# Altium project LTEWatch.PrjPcb (part 1 of 3)
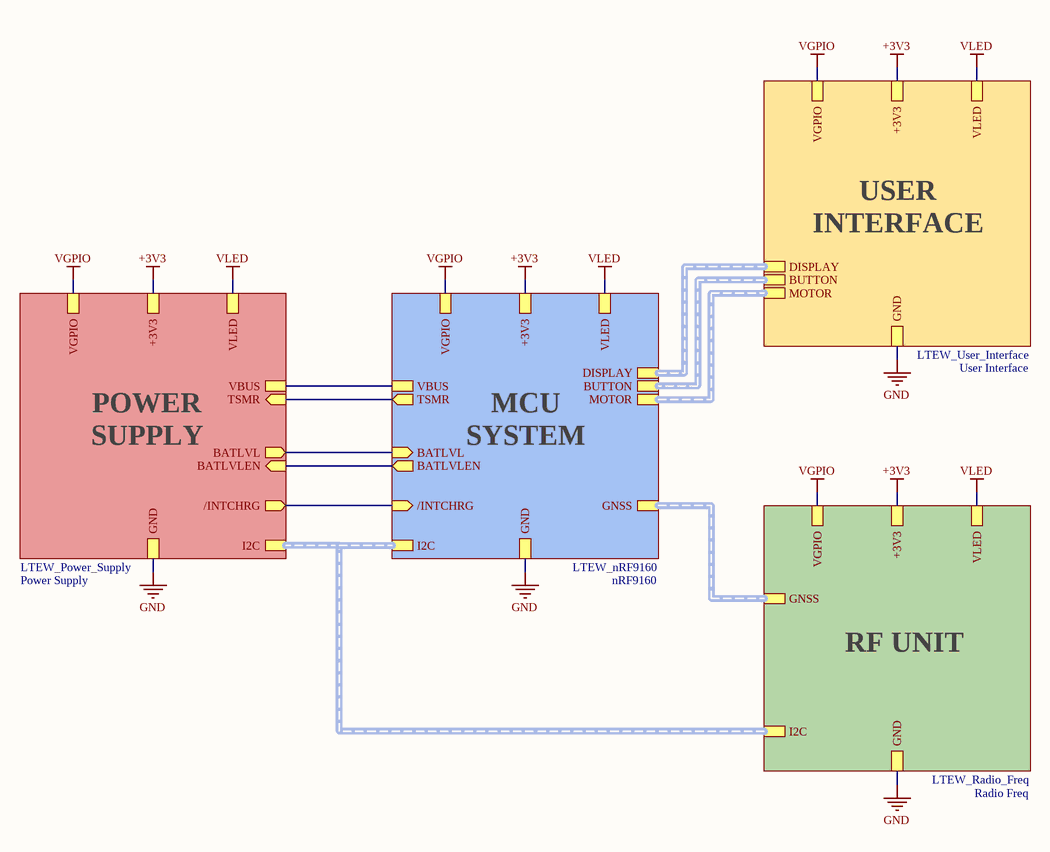
[diagram p0: LTEWatch.SchDoc]
PcbDate: 19.10.2021; PcbDesigner: Gas; PcbRevision: 1.0; SchematicDate: 19.10.2021; SchematicDesigner: Traiber T.; SchematicRevision: 1.0
6 sheets, 336 parts. Net scope: hierarchical (ports join the sheet entries above them; power ports are global).
Board file: LTEWatch.PcbDoc
Sheets:
  LTEWatch.SchDoc
    Power Supply = LTEW_Power_Supply.SchDoc
      Wireless Power Receiver = LTEW_WPC_RCVR.SchDoc
    nRF9160 = LTEW_nRF9160.SchDoc
    User Interface = LTEW_User_Interface.SchDoc
    Radio Freq = LTEW_Radio_Freq.SchDoc

## Sheet LTEWatch.SchDoc: LTEWatch
size A4; Author: Tristan Traiber; DrawnBy: Tristan Traiber; Engineer: Tristan Traiber; Organization: MSE HES-SO; Address1: HEVS; Address3: Tristan Traiber; DocumentNumber: 1; Revision: 1.0; SheetNumber: 1; SheetTotal: 6

### Sub-sheets
nRF9160 = LTEW_nRF9160: TSMR (out), BATLVL (in), +3V3, GND, BATLVLEN (out), VGPIO, /INTCHRG (in), VLED, DISPLAY (harness DISPLAY), BUTTON (harness BTN_BUS), GNSS (harness GNSS), I2C (harness I2C), VBUS, MOTOR (harness MOTOR)
Power Supply = LTEW_Power_Supply: /INTCHRG (out), +3V3, TSMR (in), GND, BATLVLEN (in), VGPIO, VLED, BATLVL (out), I2C (harness I2C), VBUS
Radio Freq = LTEW_Radio_Freq: GND, VGPIO, +3V3, VLED, GNSS (harness GNSS), I2C (harness I2C)
User Interface = LTEW_User_Interface: GND, VGPIO, +3V3, VLED, DISPLAY (harness DISPLAY), BUTTON (harness BTN_BUS), MOTOR (harness LED_BUS)

### Nets
+3V3: sheet Power Supply/+3V3, sheet nRF9160/+3V3, sheet User Interface/+3V3, sheet Radio Freq/+3V3
GND: sheet Power Supply/GND, sheet nRF9160/GND, sheet User Interface/GND, sheet Radio Freq/GND
VBUS: sheet Power Supply/VBUS, sheet nRF9160/VBUS
VGPIO: sheet Power Supply/VGPIO, sheet nRF9160/VGPIO, sheet User Interface/VGPIO, sheet Radio Freq/VGPIO
VLED: sheet Power Supply/VLED, sheet nRF9160/VLED, sheet User Interface/VLED, sheet Radio Freq/VLED
/INT: sheet Power Supply//INTCHRG, sheet nRF9160//INTCHRG
BAT_LVL: sheet Power Supply/BATLVL, sheet nRF9160/BATLVL
BAT_LVL_EN: sheet Power Supply/BATLVLEN, sheet nRF9160/BATLVLEN
BAT_TSMR: sheet Power Supply/TSMR, sheet nRF9160/TSMR

### Buses and harness runs
harness sheet nRF9160/BUTTON = sheet User Interface/BUTTON
harness sheet nRF9160/DISPLAY = sheet User Interface/DISPLAY
harness sheet nRF9160/GNSS = sheet Radio Freq/GNSS
harness sheet nRF9160/I2C = sheet Power Supply/I2C = sheet Radio Freq/I2C
harness sheet nRF9160/MOTOR = sheet User Interface/MOTOR

### Notes on the sheet
- USER INTERFACE
- POWER SUPPLY
- MCU SYSTEM
- RF UNIT
- Title
- Size:
- Date:
- A4
- Number:
- Time:
- Revision:
- Sheet
- of
- File:

## Sheet LTEW_Power_Supply.SchDoc: LTEW_Power_Supply
size A4; Author: Tristan Traiber; CompanyName: MSE HES-SO; DrawnBy: Tristan Traiber; Engineer: Tristan Traiber; Organization: MSE HES-SO; Address1: HEVS; Address3: Tristan Traiber; DocumentNumber: 3; Revision: 1.0; SheetNumber: 3; SheetTotal: 6
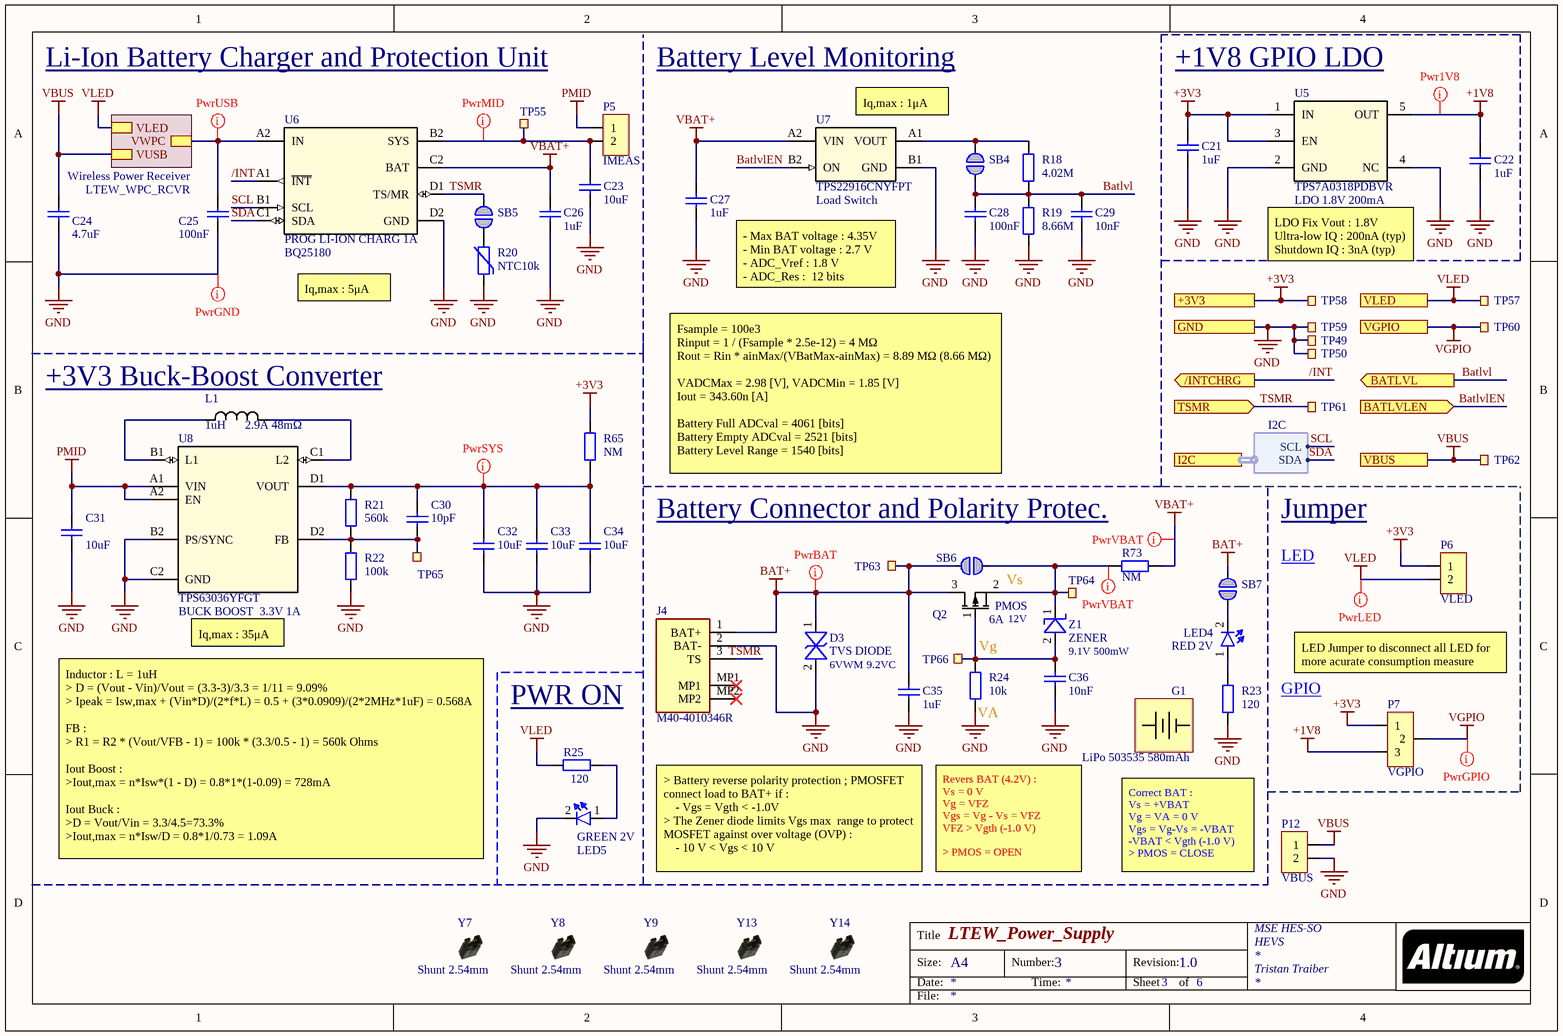
[diagram p1: LTEW_Power_Supply.SchDoc]

### Parts
C21  1uF  [C0603]
C22  1uF  [C0603]
C23  10uF  [C0603]
C24  4.7uF  [C0603]
C25  100nF  [C0603]
C26  1uF  [C0603]
C27  1uF  [C0603]
C28  100nF  [C0603]
C29  10nF  [C0603]
C30  10pF  [C0603]
C31  10uF  [C0603]
C32  10uF  [C0603]
C33  10uF  [C0603]
C34  10uF  [C0603]
C35  1uF  [C0603]
C36  10nF  [C0603]
D3  TVS DIODE  value 6VWM 9.2VC  [SP100701ETG]
G1  LiPo 503535 580mAh  [Battery_Lipo_503535]
J4  M40-4010346R  [M404010346R]
L1  2.9A 48mΩ  value 1uH  [1286ASH1R0MP2]
LED4  RED 2V  [LEDC1608X80N]
LED5  GREEN 2V  [LEDC1608X80N]
P5  IMEAS  [HDR1X2 - IMEAS]
P6  VLED  [HDR1X2 - VLED]
P7  VGPIO  [HDR1X3 - VGPIO]
P12  VBUS  [HDR1X2 - VIN]
Q2  PMOS  value 12V  Value2: 6A  [SSM3J332RLFT]
R18  4.02M  [RES0603]
R19  8.66M  [RES0603]
R20  NTC10k  [C0603]
R21  560k  [RES0603]
R22  100k  [RES0603]
R23  120  [RES0603]
R24  10k  [RES0603]
R25  120  [RES0603]
R65  NM  [RES0603]
R73  NM  [RES0603]
SB4  Solderbridge  [Solderbridge]  (value not drawn)  (no BOM)
SB5  Solderbridge  [Solderbridge]  (value not drawn)  (no BOM)
SB6  Solderbridge  [Solderbridge]  (value not drawn)  (no BOM)
SB7  Solderbridge  [Solderbridge]  (value not drawn)  (no BOM)
TP49  Ø1.0mm,SMD  [TP_SMD_Ø0.8mm]  (value not drawn)  (no BOM)
TP50  Ø1.0mm,SMD  [TP_SMD_Ø0.8mm]  (value not drawn)  (no BOM)
TP55  Ø1.0mm,SMD  [TP_SMD_Ø0.8mm]  (value not drawn)  (no BOM)
TP57  Ø1.0mm,SMD  [TP_SMD_Ø0.8mm]  (value not drawn)  (no BOM)
TP58  Ø1.0mm,SMD  [TP_SMD_Ø0.8mm]  (value not drawn)  (no BOM)
TP59  Ø1.0mm,SMD  [TP_SMD_Ø0.8mm]  (value not drawn)  (no BOM)
TP60  Ø1.0mm,SMD  [TP_SMD_Ø0.8mm]  (value not drawn)  (no BOM)
TP61  Ø1.0mm,SMD  [TP_SMD_Ø0.8mm]  (value not drawn)  (no BOM)
TP62  Ø1.0mm,SMD  [TP_SMD_Ø0.8mm]  (value not drawn)  (no BOM)
TP63  Ø1.0mm,SMD  [TP_SMD_Ø0.8mm]  (value not drawn)  (no BOM)
TP64  Ø1.0mm,SMD  [TP_SMD_Ø0.8mm]  (value not drawn)  (no BOM)
TP65  Ø1.0mm,SMD  [TP_SMD_Ø0.8mm]  (value not drawn)  (no BOM)
TP66  Ø1.0mm,SMD  [TP_SMD_Ø0.8mm]  (value not drawn)  (no BOM)
U5  TPS7A0318PDBVR  value LDO 1.8V 200mA  [SOT95P280X145-5N]
U6  BQ25180  value PROG LI-ION CHARG 1A  [BGA8C40P2X4_100X155X50]
U7  TPS22916CNYFPT  value Load Switch  [BGA4C40P2X2_78X78X50]
U8  TPS63036YFGT  value BUCK BOOST  3.3V 1A  [BGA8C40P2X4_108X181X62]
Y7  Shunt 2.54mm  [Shunt_2.54mm_Horizontal]
Y8  Shunt 2.54mm  [Shunt_2.54mm_Horizontal]
Y9  Shunt 2.54mm  [Shunt_2.54mm_Horizontal]
Y13  Shunt 2.54mm  [Shunt_2.54mm_Horizontal]
Y14  Shunt 2.54mm  [Shunt_2.54mm_Horizontal]
Z1  ZENER  value 9.1V 500mW  [SOD3716X145N]

### Sub-sheets
Wireless Power Receiver = LTEW_WPC_RCVR: VWPC, VLED, VUSB

### Ports
+3V3, /INTCHRG (out), BATLVL (out), BATLVLEN (in), GND, I2C (harness I2C), TSMR (in), VBUS, VGPIO, VLED

### Harnesses
I2C: SCL, SDA

### Nets
+1V8: C22.2 P7.3 U5.5(OUT)
+3V3: C21.2 P6.1 P7.1 R65.2 TP58.1 U5.1(IN) U5.3(EN) ; port +3V3
BAT+: C35.2 D3.1 J4.1(BAT+) Q2.3(D) SB6.1 SB7.1 TP63.1
GND: C21.1 C22.1 C23.1 C24.2 C25.1 C26.1 C27.1 C28.1 C29.1 C31.1 C32.1 C33.1 C34.1 C35.1 C36.1 D3.2 J4.2(BAT-) LED5.2(K) P12.2 R19.1 R20.1 R22.1 R23.1 R24.1 TP49.1 TP50.1 TP59.1 U5.2(GND) U5.4(NC) U6.D2(GND) U7.B1(GND) U8.B2(PS/SYNC) U8.C2(GND) ; port GND
PMID: C31.2 P5.1 U8.A1(VIN) U8.A2(EN)
VBAT+: C26.2 C27.2 R73.1 U6.C2(BAT) U7.A2(VIN)
VBUS: C24.1 P12.1 TP62.1 ; port VBUS, sheet Wireless Power Receiver/VUSB
VGPIO: P7.2 TP60.1 ; port VGPIO
VLED: P6.2 R25.1 TP57.1 ; port VLED, sheet Wireless Power Receiver/VLED
/INT: U6.A1(~{INT}) ; port /INTCHRG
Batlvl: C28.2 C29.2 R18.1 R19.2 SB4.2 ; port BATLVL  [project net BAT_LVL]
BatlvlEN: U7.B2(ON) ; port BATLVLEN  [project net BAT_LVL_EN]
SCL: U6.B1(SCL) ; port I2C.SCL  [project net P0.09/SCL]
SDA: U6.C1(SDA) ; port I2C.SDA  [project net P0.08/SDA]
TSMR: J4.3(TS) SB5.1 TP61.1 U6.D1(TS/MR) ; port TSMR  [project net BAT_TSMR]
VWPC: C25.2 U6.A2(IN) ; sheet Wireless Power Receiver/VWPC
NetC23_2: C23.2 P5.2 TP55.1 U6.B2(SYS)
NetC30_1: C30.1 R21.1 R22.2 TP65.1 U8.D2(FB)
NetC30_2: C30.2 C32.2 C33.2 C34.2 R21.2 R65.1 U8.D1(VOUT)
NetC36_2: C36.2 Q2.1(G) R24.2 TP66.1 Z1.2(A)
NetL1_1: L1.1 U8.C1(L2)
NetL1_2: L1.2 U8.B1(L1)
NetLED4_1: LED4.1(A) R23.2
NetLED4_2: LED4.2(K) SB7.2
NetLED5_1: LED5.1(A) R25.2
NetQ2_2: Q2.2(S) R73.2 SB6.2 TP64.1 Z1.1(K)
NetR18_2: R18.2 SB4.1 U7.A1(VOUT)
NetR20_2: R20.2 SB5.2

Not connected (* = marked no-connect by the designer): J4 MP1* MP2*

### Layout directives
mark named PwrUSB: VWPC
mark named PwrMID: NetC23_2
mark named PwrSYS: NetC30_2
mark named PwrGND: GND
mark named PwrVBAT: NetQ2_2, VBAT+
mark named PwrBAT: BAT+
mark named PwrGPIO: VGPIO
mark named Pwr1V8: +1V8
mark named PwrLED: VLED

### Notes on the sheet
- Li-Ion Battery Charger and Protection Unit
- Battery Level Monitoring
- (near U7) Iq,max : 1μA
- (near U5) +1V8 GPIO LDO
- (near U6) Iq,max : 5μA
- - Max BAT voltage : 4.35V
  - Min BAT voltage : 2.7 V
  - ADC_Vref : 1.8 V
  - ADC_Res :  12 bits
- LDO Fix Vout : 1.8V
  Ultra-low IQ : 200nA (typ)
  Shutdown IQ : 3nA (typ)
- (near L1) +3V3 Buck-Boost Converter
- Fsample = 100e3
  Rinput = 1 / (Fsample * 2.5e-12) = 4 MΩ
  Rout = Rin * ainMax/(VBatMax-ainMax) = 8.89 MΩ (8.66 MΩ)
  VADCMax = 2.98 [V], VADCMin = 1.85 [V]
  Iout = 343.60n [A]
  Battery Full ADCval = 4061 [bits]
  Battery Empty ADCval = 2521 [bits]
  Battery Level Range = 1540 [bits]
- Battery Connector and Polarity Protec.
- Vs
- LED
- Jumper
- (near U8) Iq,max : 35μA
- Vg
- (near R25) PWR ON
- (near R24) VA
- GPIO
- LED Jumper to disconnect all LED for more acurate consumption measure
- Inductor : L = 1uH
  > D = (Vout - Vin)/Vout = (3.3-3)/3.3 = 1/11 = 9.09%
  > Ipeak = Isw,max + (Vin*D)/(2*f*L) = 0.5 + (3*0.0909)/(2*2MHz*1uF) = 0.568A
  FB :
  > R1 = R2 * (Vout/VFB - 1) = 100k * (3.3/0.5 - 1) = 560k Ohms
  Iout Boost :
  >Iout,max = n*Isw*(1 - D) = 0.8*1*(1-0.09) = 728mA
  Iout Buck :
  >D = Vout/Vin = 3.3/4.5=73.3%
  >Iout,max = n*Isw/D = 0.8*1/0.73 = 1.09A
- > Battery reverse polarity protection ; PMOSFET connect load to BAT+ if :
  - Vgs = Vgth < -1.0V
  > The Zener diode limits Vgs max  range to protect MOSFET against over voltage (OVP) :
  - 10 V < Vgs < 10 V
- Revers BAT (4.2V) :
  Vs = 0 V
  Vg = VFZ
  Vgs = Vg - Vs = VFZ
  VFZ > Vgth (-1.0 V)
  > PMOS = OPEN
- Correct BAT :
  Vs = +VBAT
  Vg = VA = 0 V
  Vgs = Vg-Vs = -VBAT
  -VBAT < Vgth (-1.0 V)
  > PMOS = CLOSE
- Title
- Size:
- Date:
- A4
- Number:
- Time:
- Revision:
- Sheet
- of
- File:

### Library data of the parts
C21 C22 C26 C27 C35 = C_1u: 1 µF ±10% 25V Ceramic Capacitor X7R 0603 (1608 Metric); Manufacturer_Part_Number: CL10B105KA8NNNC; Manufacturer_Name: Samsung Electro-Mechanics; Supplier 1: Mouser; Supplier Part Number 1: 187-CL10B105KA8NNNC; Value: 1uF; Price Unit: 0.10
C23 C31-C34 = C_10u: 10 µF ±10% 25V Ceramic Capacitor X5R 0805 (2012 Metric); Manufacturer_Part_Number: GRM188R61E106KA73J; Manufacturer_Name: Murata Electronics; Supplier 1: Mouser; Value: 10uF; Supplier Part Number 1: 81-GRM188R61E106KA3J; Unit Price: 0.280
C24 = C_4.7u: 4.7 µF ±10% 25V Condensateurs céramique X6S 0603 (1608 métrique); Manufacturer_Part_Number: GRM188C81E475KE11D; Manufacturer_Name: Murata Electronics; Supplier 1: Digi-Key; Value: 4.7uF; Supplier Part Number 1: 490-7199-1-ND; Unit Price: 0.24
C25 C28 = C_100n: 0.1 µF ±10% 25V Condensateurs céramique X7R 0603 (1608 métrique); Manufacturer_Part_Number: CL10B104KA8NNNC; Manufacturer_Name: Samsung Electro-Mechanics; Supplier 1: Digi-Key; Value: 100nF; Supplier Part Number 1: 1276-1006-1-ND; Unit Price: 0.10
C29 C36 = C_10n: 10000 pF ±5% 25V Condensateurs céramique C0G, NP0 0603 (1608 métrique); Manufacturer_Part_Number: C1608C0G1E103J080AA; Manufacturer_Name: TDK Corporation; Value: 10nF; Supplier 1: Digi-Key; Supplier Part Number 1: 445-2664-1-ND; Unit Price: 0.270
C30 = C_10p: 10 pF ±5% 50V Ceramic Capacitor C0G, NP0 0603 (1608 Metric); Manufacturer_Part_Number: 06035A100JAT2A; Manufacturer_Name: KYOCERA AVX; Supplier 1: Digi-Key; Value: 10pF; Supplier Part Number 1: 478-1163-1-ND; Unit Price: 0.10
D3 = D_TVS: 9.2V Clamp 5A (8/20µs) Ipp Tvs Diode Surface Mount SOD-882; Manufacturer_Name: LITTELFUSE; Manufacturer_Part_Number: SP1007-01ETG; Datasheet Link: https://www.littelfuse.com/~/media/electronics/datasheets/tvs_diode_arrays/littelfuse_tvs_diode_array_sp1007_datasheet.pdf.pdf; Height: 0.6mm; Supplier 1: Digi-Key; Supplier Part Number 1: F6187CT-ND; Unit Price: 0.40
G1 = Battery: 503535 3.8v 580mAh round lipo battery cells / (Order : shorturl.at/tEFMZ); ComponentLink1Description: Order; ComponentLink1URL: https://batteryzone.de/products/503535-580mah-hochspannung-3-8v-runde-polymer-smart-watch-moxibustion-instrument-auto-smart-box-batterie?_pos=1&_sid=59cfd2d74&_ss=r; Value: LiPo 503535 580mAh; Manufacturer_Name: -; Manufacturer_Part_Number: https://batteryzone.de/products/503535-580mah-hochspannung-3-8v-runde-polymer-smart-watch-moxibustion-instrument-auto-smart-box-batterie?_pos=1&_sid=59cfd2d74&_ss=r; Supplier Part Number 1: https://batteryzone.de/products/503535-580mah-hochspannung-3-8v-runde-polymer-smart-watch-moxibustion-instrument-auto-smart-box-batterie?_pos=1&_sid=59cfd2d74&_ss=r; Unit Price: 12.50
J4 = CON_BAT_3POS: Connector Header Surface Mount, Right Angle 3 position 0.039" (1.00mm); Manufacturer_Name: Harwin; Datasheet Link: https://cdn.harwin.com/pdfs/M40-401.pdf; Height: 3.25mm; Manufacturer_Part_Number: M40-4010346R; Mouser Part Number: 855-M40-4010346R; Mouser Price/Stock: https://www.mouser.co.uk/ProductDetail/Harwin/M40-4010346R?qs=ulE8k0yEMYbY8tNiZulTaA%3D%3D; Supplier 1: Digi-Key; Supplier Part Number 1: M40-4010346R-ND
L1 = L_1u: 1 µH Shielded Drum Core, Wirewound Inductor 2.9 A 48mOhm Max 0806 (2016 Metric); Manufacturer_Part_Number: DFE201612E-1R0M=P2; Manufacturer_Name: Murata Electronics; Copyright: Copyright (C) 2022 Ultra Librarian. All rights reserved.; Supplier 1: Digi-Key; Supplier Part Number 1: 490-16593-1-ND; Unit Price: 0.35
LED4 = LED_R: Red 625nm LED Indication - Discrete 2V 0603 (1608 Metric); Manufacturer_Name: QT Brightek (QTB); Manufacturer_Part_Number: 150060RS75000; Datasheet Link: http://www.qt-brightek.com/datasheet/QBLP617_series.pdf; Height: 1.3mm; Supplier 1: Digi-Key; Supplier Part Number 1: 732-4978-1-ND; Unit Price: 0.15
LED5 = LED_G: Green 570nm LED Indication - Discrete 2V 0603 (1608 Metric); Manufacturer_Name: QT Brightek (QTB); Manufacturer_Part_Number: 150060VS75000; Datasheet Link: http://www.qt-brightek.com/datasheet/QBLP617_series.pdf; Height: 1.3mm; Supplier 1: Digi-Key; Supplier Part Number 1: 732-4980-1-ND; Unit Price: 0.15
P5 P6 P12 = H_2POS: Header, 2-Pin; Manufacturer_Part_Number: 10129378-902001BLF; Manufacturer_Name: Amphenol ICC (FCI); Supplier 1: Mouser; Supplier Part Number 1: 649-1012937890201BLF; Unit Price: 0.10
P7 = H_3POS: Header, 3-Pin; Manufacturer_Name: Harwin Inc.; Manufacturer_Part_Number: M20-9990345; Supplier 1: Digi-key; Supplier Part Number 1: 952-2263-ND; Unit Price: 0.17
Q2 = MOS-P: P-Channel 12 V 6A (Ta) 1W (Ta) Surface Mount SOT-23F; Manufacturer_Name: Toshiba; Manufacturer_Part_Number: SSM3J338R; Datasheet Link: http://toshiba.semicon-storage.com/info/docget.jsp?did=30384&prodName=SSM3J338R; Supplier 1: Digi-Key; Supplier Part Number 1: SSM3J338RLFCT-ND; Unit Price: 0.38
R18 = R_4M: 4.02 MOhms ±1% 0,1W, 1/10W Pavé résistif 0603 (1608 métrique) Résistant à l’humidité Couche épaisse; Manufacturer_Part_Number: RC0603FR-074M02L; Manufacturer_Name: YAGEO; Value: 4.02M; Supplier 1: Digi-Key; Supplier Part Number 1: YAG5698CT-ND; Unit Price: 0.10
R19 R65 R73 = R_8.66M: 8.66 MOhms ±1% 0,1W, 1/10W Pavé résistif 0603 (1608 métrique) AutomobileAEC-Q200 Couche épaisse; Manufacturer_Part_Number: CRCW06038M66FKEA; Manufacturer_Name: YAGEO; Supplier 1: Digi-Key; Supplier Part Number 1: 541-8.66MHCT-ND; Unit Price: 0.10
  R19: Value: 8.66M
  R65 R73: Value: NM
R20 = R_NTC_10k: NTC Thermistor 10k 0603 (1608 Metric); Manufacturer_Part_Number: ERT-J1VR103J; Manufacturer_Name: Panasonic; Value: NTC10k; Supplier 1: Digi-Key; Supplier Part Number 1: P10547CT-ND; Unit Price: 0.18
R21 = R_560k: 560 kOhms ±1% 0.1W, 1/10W Chip Resistor 0603 (1608 Metric) Automotive AEC-Q200, Moisture Resistant Thick Film; Manufacturer_Part_Number: AC0603FR-07560KL; Manufacturer_Name: YAGEO; Value: 560k; Supplier 1: Digi-Key; Supplier Part Number 1: 311-560KLDCT-ND; Unit Price: 0.10
R22 = R_100k: RES SMD 100K OHM 1% 1/8W 0603; Manufacturer_Part_Number: RC0805FR-07100KL; Manufacturer_Name: YAGEO; Supplier 1: Digi-Key; Supplier Part Number 1: 311-100KCRCT-ND; Value: 100k; Unit Price: 0.10
R23 R25 = R_120: 1 MOhms ±1% 0.1W, 1/10W Chip Resistor 0603 (1608 Metric) Automotive AEC-Q200 Thick Film; Manufacturer_Part_Number: CRGCQ0603F120R; Manufacturer_Name: YAGEO; Value: 120; Supplier 1: Digi-Key; Supplier Part Number 1: A129677CT-ND; Unit Price: 0.10
R24 = R_10k: 10 kOhms ±1% 0.1W, 1/10W Chip Resistor 0603 (1608 Metric) Moisture Resistant Thick Film; Manufacturer_Part_Number: RC0805FR-0710KL; Manufacturer_Name: YAGEO; Value: 10k; Supplier 1: Digi-Key; Supplier Part Number 1: 311-10.0KHRCT-ND; Unit Price: 0..10
SB4-SB7 = Solderbridge: Manufacturer: N.A.; Pad Count: 2; Part Number: Solderbridge; Manufacturer Part Number: N.A.; LatestRevisionDate: 2009-12-14; Published: 2009-12-14; Value: Solderbridge; Note: N.A.; Artikkelnr Noca: N.A.; Footprint Doc: Solderbridge; Part number IPS: N.A.; ComponentLink1URL: N.A.; ComponentLink1Description: Datasheet; ComponentLink2URL: N.A.; ComponentLink2Description: Supplier link; HelpURL: N.A.; Supplier 1: N.A.; Supplier Part Number 1: N.A.; Supplier 2: N.A.; Supplier Part Number 2: N.A.; PartId: 100500458; Component Class: Connectors
TP49 TP50 TP55 TP57-TP66 = TP_SMD: 0.8 mm circular SMD testpad; Part Number: TP_SMD_Ø1.0MM; Manufacturer: Nordic Semiconductor; Manufacturer Part Number: N.A.; Pad Count: 1; ComponentLink1URL: N.A.; ComponentLink1Description: Datasheet; ComponentLink2URL: N.A.; ComponentLink2Description: Supplier link; HelpURL: N.A.; Footprint Doc: TP_SMD_Ø1.0mm; LatestRevisionDate: 2013-06-11; Published: 2013-06-11; Value: Ø1.0mm,SMD; Note: N.A.; Supplier 1: N.A.; Supplier Part Number 1: N.A.; Supplier 2: N.A.; Supplier Part Number 2: N.A.; Artikkelnr Noca: N.A.; Part number IPS: N.A.; PartId: 100500475; Component Class: Connectors
U5 = IC_TPS7A0318PDBVR: Linear Voltage Regulator IC Positive Fixed 1 Output 200mA SOT-23-5; Manufacturer_Part_Number: TPS7A0312PDBVR; Manufacturer_Name: Texas Instruments; Type: DEV; Supplier 1: Digi-Key; Copyright: Copyright (C) 2022 Ultra Librarian. All rights reserved.; Supplier Part Number 1: 296-TPS7A0318PDBVRCT-ND; Unit Price: 0.93
U6 = IC_BQ25180YBGT: Charger IC Lithium Ion/Polymer, Lithium Iron Phosphate 8-DSBGA; Manufacturer_Part_Number: BQ25180YBGR; Manufacturer_Name: Texas Instruments; Type: DEV; Copyright: Copyright (C) 2022 Ultra Librarian. All rights reserved.; Supplier 1: Mouser; Supplier Part Number 1: 595-BQ25180YBGR; Unit Price: 2.75
U7 = SW_LOAD_SW: Power Switch/Driver 1:1 P-Channel 2A 4-DSBGA; Manufacturer_Name: Texas Instruments; Type: DEV; RefDes: RefDes; Copyright: Copyright (C) 2022 Ultra Librarian. All rights reserved.; Manufacturer_Part_Number: TPS22916CNYFPT; Supplier 1: Mouser; Supplier Part Number 1: 595-TPS22916CNYFPT; Unit Price: 1.22
U8 = IC_TPS63036YFGT: Buck-Boost Switching Regulator IC Positive Adjustable 1.2V 1 Output 1A (Switch) 8-UFBGA, DSBGA; Mfr_Name: Texas Instruments; Copyright: Copyright (C) 2022 Ultra Librarian. All rights reserved.; Supplier 1: Mouser; Supplier Part Number 1: 595-TPS63036YFGT; Manufacturer_Part_Number: TPS63036YFGT; Unit Price: 2.69
Y7-Y9 Y13 Y14 = SHUNT JUMPER 2.54mm BLACK GOLD Horizontal: Shunt Jumper 2.54mm Black; Manufacturer Part Number: SPC02SYAN; Manufacturer_Name: Sullins Connector Solutions; ComponentLink1URL: N.A.; ComponentLink1Description: Datasheet; ComponentLink2URL: N.A.; ComponentLink2Description: Supplier link; Footprint Doc: SHUNT JUMPER 2.54mm; Value: Shunt 2.54mm; Component Class: Connectors; Supplier 1: Digi-Key; Supplier Part Number 1: S9001-ND; Unit Price: 0.10
Z1 = D_ZENER_9V1: Zener Diode 9.1 V 500 mW ±6% Surface Mount SOD-123; Manufacturer_Name: Diodes Inc.; Manufacturer_Part_Number: BZT52C9V1S-7-F; Datasheet Link: https://www.diodes.com/assets/Datasheets/ds18004.pdf; Height: 1.45mm; Supplier 1: Digi-Key; Supplier Part Number 1: BZT52C9V1-FDICT-ND; Unit Price: 0.30

## Sheet LTEW_WPC_RCVR.SchDoc: LTEW_WPC_RCVR
size A4; DrawnBy: Tristan Traiber; Engineer: Tristan Traiber; Organization: MSE HES-SO; Address1: HEVS; Address3: Tristan Traiber; DocumentNumber: 4; Revision: 1.0; SheetNumber: 4; SheetTotal: 6
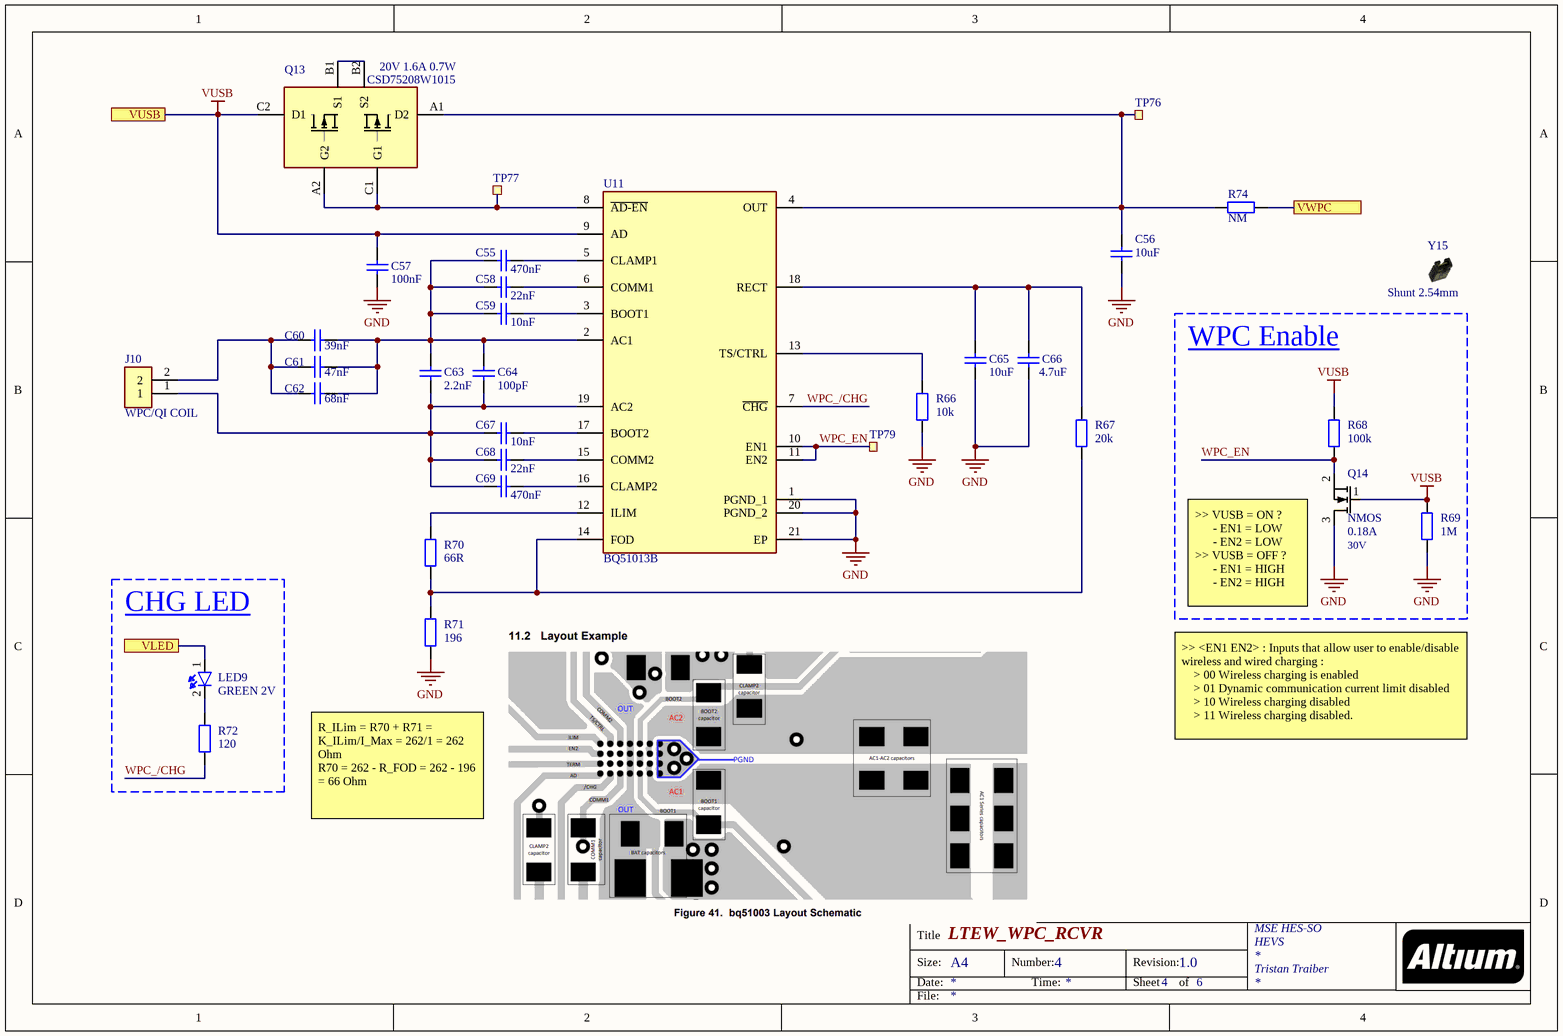
[diagram p2: LTEW_WPC_RCVR.SchDoc]

### Parts
C55  470nF  [C0603]
C56  10uF  [C0603]
C57  100nF  [C0603]
C58  22nF  [C0603]
C59  10nF  [C0603]
C60  39nF  [C0603]
C61  47nF  [C0603]
C62  68nF  [C0603]
C63  2.2nF  [C0603]
C64  100pF  [C0603]
C65  10uF  [C0603]
C66  4.7uF  [C0603]
C67  10nF  [C0603]
C68  22nF  [C0603]
C69  470nF  [C0603]
J10  WPC/QI COIL  [23839422]
LED9  GREEN 2V  [LEDC1608X80N]
Q13  20V 1.6A 0.7W  Manufacturer_Part_Number: CSD75208W1015  [BGA6C50P2X3_95X145X62]
Q14  NMOS  value 30V  Value2: 0.18A  [SOT65P210X110-3N]
R66  10k  [RES0603]
R67  20k  [RES0603]
R68  100k  [RES0603]
R69  1M  [RES0603]
R70  66R  [RES0603]
R71  196  [RES0603]
R72  120  [RES0603]
R74  NM  [RES0603]
TP76  Ø1.0mm,SMD  [TP_SMD_Ø0.8mm]  (value not drawn)  (no BOM)
TP77  Ø1.0mm,SMD  [TP_SMD_Ø0.8mm]  (value not drawn)  (no BOM)
TP79  Ø1.0mm,SMD  [TP_SMD_Ø0.8mm]  (value not drawn)  (no BOM)
U11  BQ51013B  [BQ51050BRHLR]
Y15  Shunt 2.54mm  [Shunt_2.54mm_Horizontal]

### Blocks framed on the sheet
WPC Enable: Q14 R68 R69
CHG LED: LED9 R72

### Ports
VLED, VUSB, VWPC

### Nets
GND: C56.1 C57.1 C65.1 C66.1 Q14.3(D) R66.1 R69.1 R71.1 U11.1(PGND_1) U11.20(PGND_2) U11.21(EP)
VLED: LED9.1(A) ; port VLED
VUSB: C57.2 Q13.C2(D1) Q14.1(G) R68.2 R69.2 U11.9(AD) ; port VUSB  [project net VBUS]
VWPC: R74.1 ; port VWPC
WPC_/CHG: R72.1 U11.7(~{CHG})
WPC_EN: Q14.2(S) R68.1 TP79.1 U11.10(EN1) U11.11(EN2)
NetC55_1: C55.1 C58.1 C59.1 C60.2 C61.2 C62.2 C63.2 C64.2 U11.2(AC1)
NetC55_2: C55.2 U11.5(CLAMP1)
NetC56_2: C56.2 Q13.A1(D2) R74.2 TP76.1 U11.4(OUT)
NetC58_2: C58.2 U11.6(COMM1)
NetC59_2: C59.2 U11.3(BOOT1)
NetC60_1: C60.1 C61.1 C62.1 J10.2
NetC63_1: C63.1 C64.1 C67.1 C68.1 C69.1 J10.1 U11.19(AC2)
NetC65_2: C65.2 C66.2 R67.2 U11.18(RECT)
NetC67_2: C67.2 U11.17(BOOT2)
NetC68_2: C68.2 U11.15(COMM2)
NetC69_2: C69.2 U11.16(CLAMP2)
NetLED9_2: LED9.2(K) R72.2
NetQ13_A2: Q13.A2(G2) Q13.C1(G1) TP77.1 U11.8(~{AD-EN})
NetQ13_B1: Q13.B1(S1) Q13.B2(S2)
NetR66_2: R66.2 U11.13(TS/CTRL)
NetR67_1: R67.1 R70.1 R71.2 U11.14(FOD)
NetR70_2: R70.2 U11.12(ILIM)

### Notes on the sheet
- (near Q14) >> VUSB = ON ?
  - EN1 = LOW
  - EN2 = LOW
  >> VUSB = OFF ?
  - EN1 = HIGH
  - EN2 = HIGH
- >> <EN1 EN2> : Inputs that allow user to enable/disable wireless and wired charging :
  > 00 Wireless charging is enabled
  > 01 Dynamic communication current limit disabled
  > 10 Wireless charging disabled
  > 11 Wireless charging disabled.
- R_ILim = R70 + R71 = K_ILim/I_Max = 262/1 = 262 Ohm
  R70 = 262 - R_FOD = 262 - 196 = 66 Ohm
- Title
- Size:
- Date:
- A4
- Number:
- Time:
- Revision:
- Sheet
- of
- File:

### Library data of the parts
C55 C69 = C_470n: 0.47 µF ±10% 25V Ceramic Capacitor X7R 0603 (1608 Metric); Manufacturer_Part_Number: GRM188R71E474KA12D; Manufacturer_Name: Murata Electronics; Value: 470nF; Supplier 1: Digi-Key; Supplier Part Number 1: 490-3291-1-ND; Unit Price: 0.17
C56 C65 = C_10u: as C23 on sheet LTEW_Power_Supply; Supplier 1: Mouser; Value: 10uF; Supplier Part Number 1: 81-GRM188R61E106KA3J; Unit Price: 0.280
C57 = C_100n: as C25 on sheet LTEW_Power_Supply; Supplier 1: Digi-Key; Value: 100nF; Supplier Part Number 1: 1276-1006-1-ND; Unit Price: 0.10
C58 C68 = C_22n: 0.022 µF ±10% 25V Ceramic Capacitor X7R 0603 (1608 Metric); Manufacturer_Part_Number: C0603C223K3RAC7867; Manufacturer_Name: KEMET; Value: 22nF; Supplier 1: Digi-Key; Supplier Part Number 1: 399-C0603C223K3RAC7867CT-ND; Unit Price: 0.100
C59 C67 = C_10n: as C29 on sheet LTEW_Power_Supply; Value: 10nF; Supplier 1: Digi-Key; Supplier Part Number 1: 445-2664-1-ND; Unit Price: 0.270
C60 = C_39n: 0.039 µF ±10% 50V Ceramic Capacitor X7R 0603 (1608 Metric); Manufacturer_Part_Number: 0603B393K500CT; Manufacturer_Name: Walsin Technology Corporation; Value: 39nF; Unit Price: 0.10; Supplier 1: Digi-Key; Supplier Part Number 1: 1292-1436-1-ND
C61 = C_47n: 0.047 µF ±10% 25V Ceramic Capacitor X7R 0603 (1608 Metric); Manufacturer_Part_Number: 06033C473KAT2A; Manufacturer_Name: KYOCERA AVX; Value: 47nF; Unit Price: 0.10; Supplier 1: Digi-Key; Supplier Part Number 1: 478-1235-6-ND
C62 = C_68n: 0.068 µF ±10% 25V Ceramic Capacitor X7R 0603 (1608 Metric); Manufacturer_Part_Number: 0603B683K250CT; Manufacturer_Name: Walsin Technology Corporation; Value: 68nF; Unit Price: 0.10; Supplier 1: Digi-Key; Supplier Part Number 1: 1292-1462-1-ND
C63 = C_2.2n: 2200 pF ±5% 25V Ceramic Capacitor X7R 0603 (1608 Metric); Manufacturer_Part_Number: 06033C222JAT2A; Manufacturer_Name: KYOCERA AVX; Value: 2.2nF; Unit Price: 0.10; Supplier 1: Digi-Key; Supplier Part Number 1: 478-12683-1-ND
C64 = C_100p: 100 pF ±5% 25V Ceramic Capacitor C0G, NP0 0603 (1608 Metric); Manufacturer_Part_Number: 06033A101JAT2A; Manufacturer_Name: KYOCERA AVX; Value: 100pF; Unit Price: 0.10; Supplier 1: Digi-Key; Supplier Part Number 1: 478-06033A101JAT2ACT-ND
C66 = C_4.7u: as C24 on sheet LTEW_Power_Supply; Supplier 1: Digi-Key; Value: 4.7uF; Supplier Part Number 1: 490-7199-1-ND; Unit Price: 0.24
J10 = CONN_WPC_IND: 2 Position Wire to Board Terminal Block Horizontal with Board 0.138" (3.50mm) Surface Mount; Manufacturer_Name: TE Connectivity; Manufacturer_Part_Number: 2383942-2; Datasheet Link: https://www.te.com/commerce/DocumentDelivery/DDEController?Action=showdoc&DocId=Customer+Drawing%7F2383942%7FA1%7Fpdf%7FEnglish%7FENG_CD_2383942_A1.pdf%7F2383942-2; Height: 8.65mm; Supplier 1: Digi-Key; Supplier Part Number 1: 17-2383942-2CT-ND; Unit Price: 2.77
LED9 = LED_G: as LED5 on sheet LTEW_Power_Supply; Datasheet Link: http://www.qt-brightek.com/datasheet/QBLP617_series.pdf; Height: 1.3mm; Supplier 1: Digi-Key; Supplier Part Number 1: 732-4980-1-ND; Unit Price: 0.15
Q13 = MOS_2PCH: Mosfet Array 2 P-Channel (Dual) Common Source 20V 1.6A 750mW Surface Mount 6-DSBGA (1x1.5); Manufacturer_Name: Texas Instruments; Datasheet Link: http://www.ti.com/lit/ds/symlink/csd75208w1015.pdf; Height: 0.625mm; Value: 20V 1.6A 0.7W; Supplier 1: Digi-Key; Supplier Part Number 1: 296-38339-1-ND; Unit Price: 0.60
Q14 = MOS-N: N-Channel 30 V 180mA (Ta) 260mW (Ta), 1.1W (Tc) Surface Mount SOT-323; Manufacturer_Name: NXP; Manufacturer_Part_Number: NX3020NAKW; Datasheet Link: https://datasheetspdf.com/pdf-file/1379402/nexperia/NX3020NAKW/1; Height: 1.1mm; Supplier 1: Digi-Key; Supplier Part Number 1: 1727-1288-1-ND; Unit Price: 0.30
R66 = R_10k: as R24 on sheet LTEW_Power_Supply; Value: 10k; Supplier 1: Digi-Key; Supplier Part Number 1: 311-10.0KHRCT-ND; Unit Price: 0..10
R67 = R_20k: 20 kOhms ±1% 0.1W, 1/10W Chip Resistor 0603 (1608 Metric) Moisture Resistant Thick Film; Manufacturer_Part_Number: RC0805FR-0710KL; Manufacturer_Name: YAGEO; Value: 20k; Supplier 1: Digi-Key; Supplier Part Number 1: 311-20.0KHRCT-ND; Unit Price: 0.10
R68 = R_100k: as R22 on sheet LTEW_Power_Supply; Supplier 1: Digi-Key; Supplier Part Number 1: 311-100KCRCT-ND; Value: 100k; Unit Price: 0.10
R69 = R_1M: 1 MOhms ±1% 0.1W, 1/10W Chip Resistor 0603 (1608 Metric) Automotive AEC-Q200 Thick Film; Manufacturer_Part_Number: ERJ-3EKF1004V; Manufacturer_Name: YAGEO; Value: 1M; Supplier 1: Digi-Key; Supplier Part Number 1: P1.00MHCT-ND; Unit Price: 0.10
R70 = R_66: 66.5 Ohms ±1% 0.1W, 1/10W Chip Resistor 0603 (1608 Metric) Moisture Resistant Thick Film; Manufacturer_Part_Number: RC0603FR-0766R5L; Manufacturer_Name: YAGEO; Value: 66R; Unit Price: 0.10; Supplier 1: Digi-Key; Supplier Part Number 1: 311-66.5HRCT-ND
R71 = R_196: 196 Ohms ±1% 0.1W, 1/10W Chip Resistor 0603 (1608 Metric) Moisture Resistant Thick Film; Manufacturer_Part_Number: RC0603FR-07196RL; Manufacturer_Name: YAGEO; Value: 196; Supplier 1: Digi-Key; Supplier Part Number 1: 311-196HRDKR-ND; Unit Price: 0.10
R72 = R_120: as R23 on sheet LTEW_Power_Supply; Value: 120; Supplier 1: Digi-Key; Supplier Part Number 1: A129677CT-ND; Unit Price: 0.10
R74 = R_8.66M: as R19 on sheet LTEW_Power_Supply; Value: NM; Supplier 1: Digi-Key; Supplier Part Number 1: 541-8.66MHCT-ND; Unit Price: 0.10
TP76 TP77 TP79 = TP_SMD: as TP49 on sheet LTEW_Power_Supply; ComponentLink1URL: N.A.; ComponentLink1Description: Datasheet; ComponentLink2URL: N.A.; ComponentLink2Description: Supplier link; HelpURL: N.A.; Footprint Doc: TP_SMD_Ø1.0mm; LatestRevisionDate: 2013-06-11; Published: 2013-06-11; Value: Ø1.0mm,SMD; Note: N.A.; Artikkelnr Noca: N.A.; Part number IPS: N.A.; Supplier 1: N.A.; Supplier Part Number 1: N.A.; Supplier 2: N.A.; Supplier Part Number 2: N.A.; PartId: 100500475; Component Class: Connectors
U11 = IC_WPC_VQFN: Wireless Power Receiver PMIC 20-VQFN (3.5x4.5); Manufacturer_Name: Texas Instruments; Manufacturer_Part_Number: BQ51013BRHLR; Datasheet Link: http://www.ti.com/lit/ds/symlink/bq51013b.pdf; Unit Price: 3.9; Supplier 1: Mouser; Supplier Part Number 1: 595-BQ51013BRHLR
Y15 = SHUNT JUMPER 2.54mm BLACK GOLD Horizontal: as Y7 on sheet LTEW_Power_Supply; ComponentLink1URL: N.A.; ComponentLink1Description: Datasheet; ComponentLink2URL: N.A.; ComponentLink2Description: Supplier link; Footprint Doc: SHUNT JUMPER 2.54mm; Value: Shunt 2.54mm; Component Class: Connectors; Supplier 1: Digi-Key; Supplier Part Number 1: S9001-ND; Unit Price: 0.10